# Altium project BEAGLEBONEBLACK_REV A5B.PrjPcb (part 5 of 6)

## Sheet P09_Ethernet.SchDoc
size A
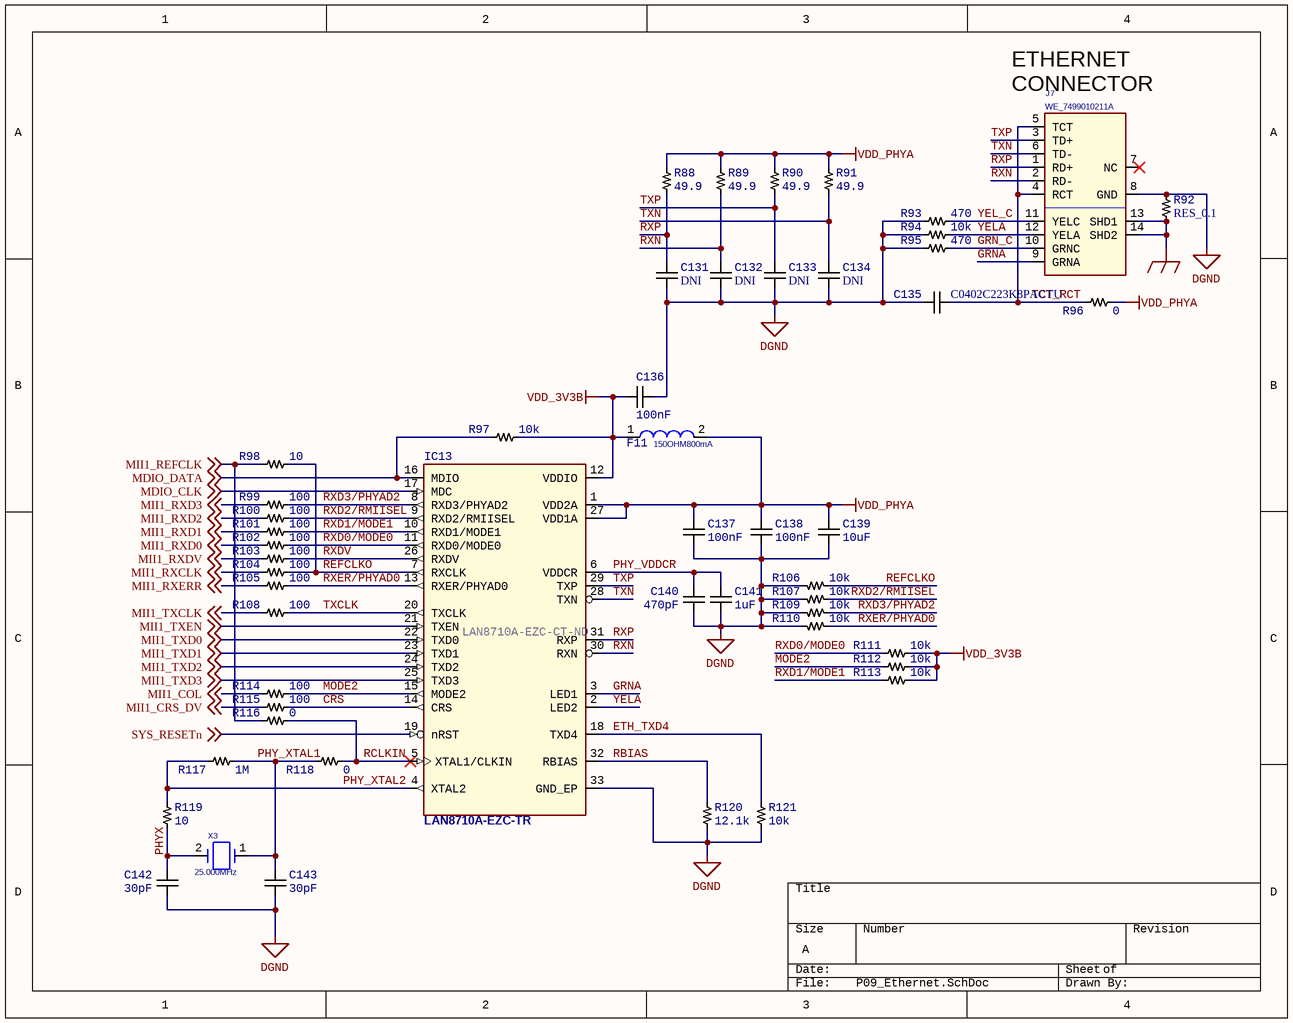
[diagram p7: P09_Ethernet.SchDoc]

### Parts
(Parts that share a designator on the sheet are numbered #1, #2 ... from top to bottom, then left to right.)
C131  DNI  [CAP0402_DNI]
C132  DNI  [CAP0402_DNI]
C133  DNI  [CAP0402_DNI]
C134  DNI  [CAP0402_DNI]
C135  C0402C223K8PACTU  [CAP0402]
C136  Capacitance: 100nF  [CAP0402]  (hidden comment: C0402C104K4RACTU)
C137  Capacitance: 100nF  [CAP0402]  (hidden comment: C0402C104K4RACTU)
C138  Capacitance: 100nF  [CAP0402]  (hidden comment: C0402C104K4RACTU)
C139  10uF  [CAP0805]
C140  470pF  [CAP0402]
C141  1uF  [CAP0402]
C142  Capacitance: 30pF  [CAP0402]  (hidden comment: CC0402JRNPO9BN300)
C143  Capacitance: 30pF  [CAP0402]  (hidden comment: CC0402JRNPO9BN300)
F11  150OHM800mA  [FB0805]
IC13  LAN8710A-EZC-TR  Supplier Part Number 2: LAN8710A-EZC-CT-ND  [QFN-32]
J7  WE_7499010211A  [RJ45-7499010211A]
R88#2  Resistance: 49.9  [RES0402]  (hidden comment: RC0402FR-0749R9)
R89#2  Resistance: 49.9  [RES0402]  (hidden comment: RC0402FR-0749R9)
R90#2  Resistance: 49.9  [RES0402]  (hidden comment: RC0402FR-0749R9)
R91#2  Resistance: 49.9  [RES0402]  (hidden comment: RC0402FR-0749R9)
R92#2  RES_0.1
R93#2  Resistance: 470  [RES0402]  (hidden comment: RC0402FR-07470RL)
R94#2  Resistance: 10k  [RES0402]  (hidden comment: RC0402FR-0710KL)
R95#2  Resistance: 470  [RES0402]  (hidden comment: RC0402FR-07470RL)
R96#2  Resistance: 0  [RES0402]  (hidden comment: RC0402JR-070RL)
R97#2  Resistance: 10k  [RES0402]  (hidden comment: RC0402FR-0710KL)
R98#2  Resistance: 10  [RES0402]  (hidden comment: RC0402FR-0710RL)
R99#2  Resistance: 100  [RES0402]  (hidden comment: RC0402FR-07100RL)
R100#2  Resistance: 100  [RES0402]  (hidden comment: RC0402FR-07100RL)
R101  Resistance: 100  [RES0402]  (hidden comment: RC0402FR-07100RL)
R102  Resistance: 100  [RES0402]  (hidden comment: RC0402FR-07100RL)
R103  Resistance: 100  [RES0402]  (hidden comment: RC0402FR-07100RL)
R104  Resistance: 100  [RES0402]  (hidden comment: RC0402FR-07100RL)
R105  Resistance: 100  [RES0402]  (hidden comment: RC0402FR-07100RL)
R106  Resistance: 10k  [RES0402]  (hidden comment: RC0402FR-0710KL)
R107  Resistance: 10k  [RES0402]  (hidden comment: RC0402FR-0710KL)
R108  Resistance: 100  [RES0402]  (hidden comment: RC0402FR-07100RL)
R109  Resistance: 10k  [RES0402]  (hidden comment: RC0402FR-0710KL)
R110  Resistance: 10k  [RES0402]  (hidden comment: RC0402FR-0710KL)
R111  Resistance: 10k  [RES0402]  (hidden comment: RC0402FR-0710KL)
R112  Resistance: 10k  [RES0402]  (hidden comment: RC0402FR-0710KL)
R113  Resistance: 10k  [RES0402]  (hidden comment: RC0402FR-0710KL)
R114  Resistance: 100  [RES0402]  (hidden comment: RC0402FR-07100RL)
R115  Resistance: 100  [RES0402]  (hidden comment: RC0402FR-07100RL)
R116  Resistance: 0  [RES0402]  (hidden comment: RC0402JR-070RL)
R117  Resistance: 1M  [RES0402]  (hidden comment: RC0402FR-071ML)
R118  Resistance: 0  [RES0402]  (hidden comment: RC0402JR-070RL)
R119  Resistance: 10  [RES0402]  (hidden comment: RC0402FR-0710RL)
R120  Resistance: 12.1k  [RES0402]  (hidden comment: RC0402FR-0712K1L)
R121  Resistance: 10k  [RES0402]  (hidden comment: RC0402FR-0710KL)
X3  25.000MHz  [XTAL150SMD_125X196]

### Nets
DGND: C131.2 C132.2 C133.2 C134.2 C135.1 C136.2 C137.2 C138.2 C139.1 C140.2 C141.2 C142.2 C143.2 IC13.33(GND_EP) J7.8(GND) R92#2.2 R93#2.2 R94#2.2 R95#2.2 R106.2 R107.2 R109.2 R110.2 R120.1 R121.1
GND_EARTH: J7.13(SHD1) J7.14(SHD2) R92#2.1
VDD_3V3B: C136.1 F11.1 IC13.12(VDDIO) R97#2.1 R111.2 R112.2 R113.2
VDD_PHYA: C137.1 C138.1 C139.2 F11.2 IC13.1(VDD2A) IC13.27(VDD1A) R88#2.1 R89#2.1 R90#2.1 R91#2.1 R96#2.1
CRS: IC13.14(CRS) R115.1
ETH_TXD4: IC13.18(TXD4) R121.2
GRN_C: J7.10(GRNC) R95#2.1
GRNA: IC13.3(LED1) J7.9(GRNA)
MDIO_CLK: IC13.17(MDC) ; off-sheet MDIO_CLK
MDIO_DATA: IC13.16(MDIO) R97#2.2 ; off-sheet MDIO_DATA
MII1_COL: R114.2 ; off-sheet MII1_COL
MII1_CRS_DV: R115.2 ; off-sheet MII1_CRS_DV
MII1_REFCLK: R98#2.2 R116.2 ; off-sheet MII1_REFCLK
MII1_RXCLK: R104.2 ; off-sheet MII1_RXCLK
MII1_RXD0: R102.2 ; off-sheet MII1_RXD0
MII1_RXD1: R101.2 ; off-sheet MII1_RXD1
MII1_RXD2: R100#2.2 ; off-sheet MII1_RXD2
MII1_RXD3: R99#2.2 ; off-sheet MII1_RXD3
MII1_RXDV: R103.2 ; off-sheet MII1_RXDV
MII1_RXERR: R105.2 ; off-sheet MII1_RXERR
MII1_TXCLK: R108.2 ; off-sheet MII1_TXCLK
MII1_TXD0: IC13.22(TXD0) ; off-sheet MII1_TXD0
MII1_TXD1: IC13.23(TXD1) ; off-sheet MII1_TXD1
MII1_TXD2: IC13.24(TXD2) ; off-sheet MII1_TXD2
MII1_TXD3: IC13.25(TXD3) ; off-sheet MII1_TXD3
MII1_TXEN: IC13.21(TXEN) ; off-sheet MII1_TXEN
MODE2: IC13.15(MODE2) R112.1 R114.1
PHY_VDDCR: C140.1 C141.1 IC13.6(VDDCR)
PHY_XTAL1: C143.1 R117.1 R118.2 X3.1
PHY_XTAL2: IC13.4(XTAL2) R117.2 R119.2
PHYX: C142.1 R119.1 X3.2
RBIAS: IC13.32(RBIAS) R120.2
RCLKIN: IC13.5(XTAL1/CLKIN) R116.1 R118.1
REFCLKO: IC13.7(RXCLK) R98#2.1 R104.1 R106.1
RXD0/MODE0: IC13.11(RXD0/MODE0) R102.1 R111.1
RXD1/MODE1: IC13.10(RXD1/MODE1) R101.1 R113.1
RXD2/RMIISEL: IC13.9(RXD2/RMIISEL) R100#2.1 R107.1
RXD3/PHYAD2: IC13.8(RXD3/PHYAD2) R99#2.1 R109.1
RXDV: IC13.26(RXDV) R103.1
RXER/PHYAD0: IC13.13(RXER/PHYAD0) R105.1 R110.1
RXN: C132.1 IC13.30(RXN) J7.2(RD-) R89#2.2
RXP: C131.1 IC13.31(RXP) J7.1(RD+) R88#2.2
SYS_RESETn: IC13.19(nRST) ; off-sheet SYS_RESETn
TCT_RCT: C135.2 J7.4(RCT) J7.5(TCT) R96#2.2
TXCLK: IC13.20(TXCLK) R108.1
TXN: C134.1 IC13.28(TXN) J7.6(TD-) R91#2.2
TXP: C133.1 IC13.29(TXP) J7.3(TD+) R90#2.2
YEL_C: J7.11(YELC) R93#2.1
YELA: IC13.2(LED2) J7.12(YELA) R94#2.1

Not connected (* = marked no-connect by the designer): J7 7(NC)*

### Notes on the sheet
- (near J7) ETHERNET
  CONNECTOR
- Title
- Size:
- Date:
- A4
- Number:
- Time:
- Revision:
- Sheet
- of
- File:

### Library data of the parts
C131-C134 = CAP_15pF_DNI: No insert capacitor
C135 = CAP_22nF: MLCC 22nF 0402 SMD; Manufacturer: KEMET; Tolerance: 10%; Dielectric Material: Ceramic; Voltage Rating: 10V; Dielectric: X5R; Dissipation Factor: 5%; Supplier 1: Digi-Key; Manufacturer Part Number: C0402C223K8PACTU; RoHS: Yes; Stock 1: 94645; Pricing 1: 1=0.30000, 10=0.20900, 100=0.11830, 500=0.08350, 1000=0.07307, 2500=0.06959, 5000=0.06437 (USD); Capacitance: 22nF; Packaging: Tape and Reel; ComponentLink1URL: https://datasheet.ciiva.com/146/docfinderpartnumber-c0402c223k8pactu-146023.pdf?src-supplier=Digi-Key; ComponentLink1Description: https://datasheet.ciiva.com/146/docfinderpartnumber-c0402c223k8pactu-146023.pdf?src-supplier=Digi-Key; Mount: Surface Mount,PCB; Case/Package: 0402; Case Code (Metric): 1005; Case Code (Imperial): 0402; Min Operating Temperature: -55°C; Max Operating Temperature: 85°C; Package Quantity: 1; Voltage Rating (DC): 10V; Termination: SMD/SMT; Voltage: 10V; Length: 1mm; Height: 0.5mm; Width: 0.02inch; Thickness: 0.022inch; Lead Pitch: 0.3mm; Depth: 0.5mm; Radiation Hardening: No; REACH SVHC: No SVHC; Lead Free: Lead Free
C136-C138 = CAP_100nF: as C107-C117 on sheet P07_DDR3 Memory; Supplier 1: Digi-Key; Supplier Part Number 1: 399-3521-1-ND; Manufacturer Part Number: C0402C104K4RACTU; RoHS: Yes; Stock 1: 6512243; Pricing 1: 1=0.10000, 10=0.04200, 100=0.01860, 500=0.01328, 1000=0.01044, 2500=0.00949, 5000=0.00873 (USD); Packaging: Tape and Reel; Mount: Surface Mount; Case/Package: 0402; Case Code (Imperial): 0402; Case Code (Metric): 1005; Contact Plating: Tin,Matte; Min Operating Temperature: -55°C; Max Operating Temperature: 125°C; Package Quantity: 10000; Voltage Rating: 16V; Termination: SMD/SMT; Length: 1mm; Height: 0.5mm; Width: 0.5mm; Depth: 0.5mm; Radiation Hardening: No; ComponentLink2URL: https://datasheet.ciiva.com/18192/getdatasheetpartid-385384-18192412.pdf?src-supplier=Verical; ComponentLink2Description: Datasheet
C139 = CAP_10uF: MLCC 10uF 0805 SMD; Manufacturer: TDK; Manufacturer Part Number: C2012X6S1A106K085AC; Tolerance: 10%; Dielectric Material: Ceramic; Voltage Rating: 10V; Dielectric: X6S; Supplier 1: Digi-Key; Supplier Part Number 1: 445-7613-1-ND; RoHS: Yes; Stock 1: 46852; Pricing 1: 1=0.30000, 10=0.20500, 100=0.11610, 500=0.08198, 1000=0.07173 (USD); Capacitance: 10uF; Packaging: Tape and Reel; Mount: Surface Mount; Case/Package: 0805; Weight: 0.000194oz; Case Code (Metric): 2012; Case Code (Imperial): 0805; Min Operating Temperature: -55°C; Max Operating Temperature: 105°C; Termination: SMD/SMT; Package Quantity: 4000; Voltage Rating (DC): 10V; Composition: Ceramic; Length: 2mm; Height: 1.25mm; Depth: 1.25mm; Width: 0.049inch; Thickness: 0.037inch; REACH SVHC: No SVHC; Lead Free: Lead Free; ComponentLink3URL: https://datasheet.ciiva.com/6290/tdkmlcccaprange-6290501.pdf?src-supplier=Digi-Key; ComponentLink3Description: Datasheet
C140 = CAP_470pF: MLCC 470pF 0402 SMD; Manufacturer: Murata; Manufacturer Part Number: GRM155R71H471KA01D; Tolerance: 10%; Material: Ceramic; Dielectric: X7R; Voltage Rating: 50V; Supplier 1: Digi-Key; Supplier Part Number 1: 490-1300-1-ND; RoHS: Yes; Stock 1: 1824670; Pricing 1: 1=0.10000, 10=0.04900, 100=0.02200, 500=0.01572, 1000=0.01235, 2500=0.01122, 5000=0.01033 (USD); Capacitance: 470pF; Packaging: Tape and Reel; ComponentLink1URL: https://datasheet.ciiva.com/11786/0900766b80ef921d-11786912.pdf?src-supplier=RSComponents; ComponentLink1Description: https://datasheet.ciiva.com/11786/0900766b80ef921d-11786912.pdf?src-supplier=RSComponents; Mount: Surface Mount; Case/Package: 0402; Number of Pins: 2; Case Code (Metric): 1005; Case Code (Imperial): 0402; Min Operating Temperature: -55°C; Max Operating Temperature: 125°C; Package Quantity: 1; Voltage Rating (DC): 50V; Termination: SMD/SMT; Voltage: 50V; Length: 1mm; Height: 0.5mm; Width: 0.02inch; Thickness: 0.022inch; Depth: 0.5mm; Radiation Hardening: No; REACH SVHC: No SVHC; Lead Free: Lead Free; ComponentLink2URL: https://datasheet.ciiva.com/18101/getdatasheetpartid-37722-18101030.pdf?src-supplier=Verical; ComponentLink2Description: https://datasheet.ciiva.com/18101/getdatasheetpartid-37722-18101030.pdf?src-supplier=Verical; ComponentLink3URL: https://datasheet.ciiva.com/19476/1856505-19476137.pdf?src-supplier=Jameco; ComponentLink3Description: https://datasheet.ciiva.com/19476/1856505-19476137.pdf?src-supplier=Jameco; ComponentLink4URL: https://datasheet.ciiva.com/29199/454340-da-01-en-vs-kondensator-0402-29199656.pdf?src-supplier=Conrad; ComponentLink4Description: https://datasheet.ciiva.com/29199/454340-da-01-en-vs-kondensator-0402-29199656.pdf?src-supplier=Conrad; ComponentLink5URL: https://datasheet.ciiva.com/129/partnumbering-e-01-129843.pdf?src-supplier=Digi-Key; ComponentLink5Description: https://datasheet.ciiva.com/129/partnumbering-e-01-129843.pdf?src-supplier=Digi-Key; ComponentLink6URL: https://datasheet.ciiva.com/129/partnumbering-e-01-129844.pdf?src-supplier=Digi-Key; ComponentLink6Description: https://datasheet.ciiva.com/129/partnumbering-e-01-129844.pdf?src-supplier=Digi-Key; ComponentLink7URL: https://datasheet.ciiva.com/129/partnumbering-e-01-129845.pdf?src-supplier=Digi-Key; ComponentLink7Description: https://datasheet.ciiva.com/129/partnumbering-e-01-129845.pdf?src-supplier=Digi-Key; ComponentLink8URL: https://datasheet.ciiva.com/14116/grmseries-highdielectrictype-eng-14116837.pdf?src-supplier=Distrelec; ComponentLink8Description: https://datasheet.ciiva.com/14116/grmseries-highdielectrictype-eng-14116837.pdf?src-supplier=Distrelec; ComponentLink9URL: https://datasheet.ciiva.com/22698/608985-22698425.pdf?src-supplier=Element14; ComponentLink9Description: https://datasheet.ciiva.com/22698/608985-22698425.pdf?src-supplier=Element14; ComponentLink10URL: https://datasheet.ciiva.com/16199/product-16199180.pdf?src-supplier=Future+Electronics; ComponentLink10Description: https://datasheet.ciiva.com/16199/product-16199180.pdf?src-supplier=Future+Electronics; ComponentLink11URL: https://datasheet.ciiva.com/7937/608985-7937630.pdf?src-supplier=Element14; ComponentLink11Description: https://datasheet.ciiva.com/7937/608985-7937630.pdf?src-supplier=Element14
C141 = CAP_1uF: MLCC 1uF 0402 SMD; Manufacturer: Yageo; Manufacturer Part Number: CC0402KRX5R6BB105; Tolerance: 10%; Dielectric: X5R; Voltage Rating: 10V; Dissipation Factor: 15%; Capacitance: 1uF; ComponentLink1Description: https://datasheet.ciiva.com/176/upy-gphc-x5r-4v-to-50v-12-176704.pdf?src-supplier=Digi-Key; ComponentLink1URL: https://datasheet.ciiva.com/176/upy-gphc-x5r-4v-to-50v-12-176704.pdf?src-supplier=Digi-Key; Packaging: Tape and Reel; Pricing 1: 1=0.10000, 10=0.06300, 100=0.02790, 500=0.01996, 1000=0.01568, 2500=0.01425, 5000=0.01311 (USD); RoHS: Yes; Stock 1: 6411796; Supplier 1: Digi-Key; Mount: Surface Mount; Case/Package: 0402; Number of Pins: 2; Case Code (Metric): 1005; Case Code (Imperial): 0402; Min Operating Temperature: -55°C; Max Operating Temperature: 85°C; Package Quantity: 1; Voltage Rating (DC): 10V; Termination: SMD/SMT; Composition: Ceramic; Length: 1mm; Height: 0.5mm; Width: 0.02inch; Thickness: 0.022inch; Depth: 0.5mm; Radiation Hardening: No; REACH SVHC: No SVHC; Lead Free: Lead Free; Halogen Free: Halogen Free; ComponentLink2URL: https://datasheet.ciiva.com/176/mlccorderingcode-176706.pdf?src-supplier=Digi-Key; ComponentLink2Description: https://datasheet.ciiva.com/176/mlccorderingcode-176706.pdf?src-supplier=Digi-Key; ComponentLink3URL: https://datasheet.ciiva.com/176/mlccorderingcode-176705.pdf?src-supplier=Digi-Key; ComponentLink3Description: https://datasheet.ciiva.com/176/mlccorderingcode-176705.pdf?src-supplier=Digi-Key
C142 C143 = CAP_30pF: MLCC 30pF 0402 SMD; Manufacturer: Yageo; Tolerance: 5%; Voltage Rating: 50V; Dielectric: C0G; Supplier 1: Digi-Key; Manufacturer Part Number: CC0402JRNPO9BN300; Stock 1: 51709; Pricing 1: 1=0.10000, 10=0.04200, 100=0.01890, 500=0.01348, 1000=0.01059, 2500=0.00962, 5000=0.00886 (USD); RoHS: Yes; Mount: Surface Mount; Case/Package: 0402; Number of Pins: 2; Weight: 2.3E-05oz; Case Code (Imperial): 0402; Case Code (Metric): 1005; Min Operating Temperature: -55°C; Max Operating Temperature: 125°C; Voltage Rating (DC): 50V; Packaging: Tape and Reel; Termination: SMD/SMT; Composition: Ceramic; Length: 1mm; Width: 0.02inch; Thickness: 0.022inch; Depth: 0.5mm; Lead Free: Lead Free; ComponentLink1URL: https://datasheet.ciiva.com/13263/upy-gp-np0-16v-to-50v-8-3714-13263961.pdf?src-supplier=Mouser; ComponentLink1Description: https://datasheet.ciiva.com/13263/upy-gp-np0-16v-to-50v-8-3714-13263961.pdf?src-supplier=Mouser; Supplier Part Number 1: 311-1666-1-ND
F11 = FERR: FERRITE 800MA 150 OHM 0805 SMD; PartName: FerriteBead150ohm800mA; Mfr: Steward; MfrNum: LI0805H151R-10; TIIntPartnumber: 1L0010; Manufacturer: Laird-Signal Integrity Products; Vendor: Digikey; DC Resistance (DCR): 150 mOhm Max; Filter Type: Differential Mode - Single; Impedance @ Frequency: 150 Ohm @ 100MHz; Category: Filters; ComponentLink1Description: http://www.lairdtech.com/WorkArea/linkit.aspx?LinkIdentifier=id&ItemID=4912; ComponentLink1URL: http://www.lairdtech.com/WorkArea/linkit.aspx?LinkIdentifier=id&ItemID=4912; Current Rating: 800mA; Height (Max): 0.043" (1.10mm); Manufacturer Part Number: LI0805H151R-10; Mounting Type: Surface Mount; Package / Case: 0805 (2012 Metric); Packaging: Digi-Reel®; Pricing 1: 1=0.1, 10=0.07, 25=0.064, 50=0.0574, 100=0.0421, 250=0.03064, 500=0.02808, 1000=0.02424 (USD); RoHS: RoHS Compliant; Size / Dimension: 0.079" L x 0.049" W (2.00mm x 1.25mm); Stock 1: 3694; Supplier 1: Digi-Key; Supplier Part Number 1: 240-2384-6-ND
IC13 = IC_Ethernet_XCVR: Ethernet ICs 10/100 Ethernet XCVR w/HPAutoMDIX FlexPwr; PART#: SMSC LAN8710A-EZK; Manufacturer: Microchip Technology; Manufacturer Part Number: LAN8710A-EZK-TR; Data Rate: 125 Mb/s; Number of Transceivers: 1; Standard Supported: 802.3, 802.3u; Supply Voltage - Max: 3.6 V; Supply Voltage - Min: 1.6 V, 3 V; Max Supply Voltage: 3.6V; Min Supply Voltage: 1.62V; Max Supply Current: 24.1mA; Number of LEDs: 4; Max Power Dissipation: 176mW; Simplex/Duplex: Full Duplex; Supplier 1: Mouser; Supplier Part Number 1: 886-LAN8710A-EZK-TR; RoHS: RoHS Compliant; Category: Ethernet ICs; Stock 1: 12109; Pricing 1: 1=1.70, 10=1.47, 25=1.23, 100=1.11, 4000=1.11 (AUD); Package / Case: QFN-32; Packaging: Reel; Product: Ethernet Transceivers; Type: Single Chip; Mounting Style: SMD/SMT; Maximum Operating Temperature: + 85 C; Minimum Operating Temperature: 0 C; Product Category: Ethernet Controllers; RoHS - Mouser: Y; Minimum Order Quantity: 1; Reeling: True; ComponentLink1URL: http://www.smsc.com/media/Downloads_Public/Data_Sheets/8710a.pdf; ComponentLink1Description: http://www.smsc.com/media/Downloads_Public/Data_Sheets/8710a.pdf; Supplier 2: Digi-Key; Stock 2: 14307; Pricing 2: 1=1.25000, 25=1.04280 (USD); Case/Package: QFN; Number of Pins: 32; Min Operating Temperature: 0°C; Max Operating Temperature: 85°C; Package Quantity: 4000; Number of Channels: 1; Length: 5.1mm; Height: 0.95mm; Width: 5.1mm; Lead Free: Lead Free; ComponentLink2URL: https://datasheet.ciiva.com/26913/getdatasheetpartid-766967-26913043.pdf?src-supplier=Verical; ComponentLink2Description: https://datasheet.ciiva.com/26913/getdatasheetpartid-766967-26913043.pdf?src-supplier=Verical; ComponentLink3URL: https://datasheet.ciiva.com/29718/8710adb-29718636.pdf?src-supplier=Digi-Key; ComponentLink3Description: https://datasheet.ciiva.com/29718/8710adb-29718636.pdf?src-supplier=Digi-Key; ComponentLink4URL: https://datasheet.ciiva.com/29718/8710adb-29718637.pdf?src-supplier=Digi-Key; ComponentLink4Description: https://datasheet.ciiva.com/29718/8710adb-29718637.pdf?src-supplier=Digi-Key
J7 = CONN_RJ45_MAG_WE_0: WE-RJ45 LAN Transformer
R88#2 R89#2 R90#2 R91#2 = RES_49.9: Resistor 49.9Ohm 0402 SMD; Manufacturer: Yageo; Manufacturer Part Number: RC0402FR-0749R9L; Temperature Coefficient: 100ppm/°C; Tolerance: 1%; Max Power Dissipation: 63mW; Power Rating: 62.5mW; Voltage Rating: 50V; ComponentLink1Description: https://datasheet.ciiva.com/11819/0900766b80c66297-11819508.pdf?src-supplier=RSComponents; ComponentLink1URL: https://datasheet.ciiva.com/11819/0900766b80c66297-11819508.pdf?src-supplier=RSComponents; Composition: Thick Film; Features: Moisture Resistant; Height: 0.016inch; Number of Terminations: 2; Packaging: Tape and Reel; Pricing 1: 1=0.10000, 10=0.01600, 100=0.00640, 1000=0.00289, 2500=0.00251, 5000=0.00207 (USD); RoHS: Yes; Stock 1: 17398038; Supplier 1: Digi-Key; Case/Package: 0402; Number of Pins: 2; Case Code (Imperial): 0402; Case Code (Metric): 1005; Min Operating Temperature: -55°C; Max Operating Temperature: 155°C; Package Quantity: 1; Termination: SMD/SMT; Military Standard: Not; Voltage Rating (DC): 50V; Working Voltage: 50V; Length: 1mm; Width: 0.5mm; Depth: 0.5mm; REACH SVHC: No SVHC; Lead Free: Lead Free; ComponentLink2URL: https://datasheet.ciiva.com/7983/1018594-7983542.pdf?src-supplier=Element14; ComponentLink2Description: https://datasheet.ciiva.com/7983/1018594-7983542.pdf?src-supplier=Element14; ComponentLink3URL: https://datasheet.ciiva.com/16743/pyu-rc0402-51-rohs-l-6-r-16743942.pdf?src-supplier=Future+Electronics; ComponentLink3Description: https://datasheet.ciiva.com/16743/pyu-rc0402-51-rohs-l-6-r-16743942.pdf?src-supplier=Future+Electronics; ComponentLink4URL: https://datasheet.ciiva.com/22747/1018594-22747514.pdf?src-supplier=Element14; ComponentLink4Description: https://datasheet.ciiva.com/22747/1018594-22747514.pdf?src-supplier=Element14; ComponentLink5URL: https://datasheet.ciiva.com/2453/pyu-r-int-thick-7-2453355.pdf?src-supplier=Digi-Key; ComponentLink5Description: https://datasheet.ciiva.com/2453/pyu-r-int-thick-7-2453355.pdf?src-supplier=Digi-Key; ComponentLink6URL: https://datasheet.ciiva.com/2453/pyu-r-int-thick-7-2453356.pdf?src-supplier=Digi-Key; ComponentLink6Description: https://datasheet.ciiva.com/2453/pyu-r-int-thick-7-2453356.pdf?src-supplier=Digi-Key; ComponentLink7URL: https://datasheet.ciiva.com/2453/pyu-r-int-thick-7-2453357.pdf?src-supplier=Digi-Key; ComponentLink7Description: https://datasheet.ciiva.com/2453/pyu-r-int-thick-7-2453357.pdf?src-supplier=Digi-Key
R92#2 = RES_0.1: Resistor 0.1Ohm 0805 SMD
R93#2 R95#2 = RES_470: Resistor 470Ohm 0402 SMD; Manufacturer: Yageo Phycomp; Temperature Coefficient: 100ppm/°C; Tolerance: 1%; Power Rating: 63mW; Voltage Rating (DC): 50V; Supplier 1: Digi-Key; Manufacturer Part Number: RC0402FR-07470RL; RoHS: Yes; Stock 1: 4454412; Pricing 1: 1=0.10000, 10=0.01600, 100=0.00640, 1000=0.00289, 2500=0.00251, 5000=0.00207 (USD); Height: 0.32mm; Number of Terminations: 2; Packaging: Cut Tape; ComponentLink1URL: http://www.farnell.com/datasheets/2167052.pdf?src-supplier=Farnell; ComponentLink1Description: http://www.farnell.com/datasheets/2167052.pdf?src-supplier=Farnell; Mount: Surface Mount; Case/Package: 0402; Number of Pins: 2; Min Operating Temperature: -55°C; Max Operating Temperature: 155°C; Working Voltage: 50V; Length: 1mm; Depth: 0.5mm; Width: 500um; REACH SVHC: No SVHC; Lead Free: Lead Free; ComponentLink2URL: http://www.yageo.com/documents/recent/PYu-RC_Group_51_RoHS_L_10.pdf?src-supplier=Digi-Key; ComponentLink2Description: http://www.yageo.com/documents/recent/PYu-RC_Group_51_RoHS_L_10.pdf?src-supplier=Digi-Key; ComponentLink3URL: http://www.farnell.com/datasheets/2167052.pdf?src-supplier=Newark; ComponentLink3Description: http://www.farnell.com/datasheets/2167052.pdf?src-supplier=Newark
R94#2 R97#2 R106 R107 R109-R113 R121 = RES_10k: Resistor 10kOhm 0402 SMD; Manufacturer: Yageo; Temperature Coefficient: 100ppm/°C; Tolerance: 1%; Voltage Rating (DC): 50V; Power Rating: 62.5mW; ComponentLink1Description: https://datasheet.ciiva.com/7660/38568-7660787.pdf?src-supplier=Element14; ComponentLink1URL: https://datasheet.ciiva.com/7660/38568-7660787.pdf?src-supplier=Element14; Composition: Thick Film; Height: 0.32mm; Manufacturer Part Number: RC0402FR-0710KL; Number of Terminations: 2; Packaging: Tape and Reel; Pricing 1: 1=0.10000, 10=0.01500, 100=0.00600, 1000=0.00270, 2500=0.00235, 5000=0.00194 (USD); RoHS: Yes; Stock 1: 72891652; Supplier 1: Digi-Key; Case/Package: 0402; Number of Pins: 2; Case Code (Imperial): 0402; Case Code (Metric): 1005; Min Operating Temperature: -55°C; Max Operating Temperature: 155°C; Voltage Rating: 50V; Termination: SMD/SMT; Military Standard: Not; Working Voltage: 50V; Length: 1mm; Width: 0.5mm; Depth: 0.5mm; Lead Pitch: 0.2mm; REACH SVHC: No SVHC; Lead Free: Lead Free; ComponentLink2URL: https://datasheet.ciiva.com/7983/1018594-7983486.pdf?src-supplier=Element14; ComponentLink2Description: https://datasheet.ciiva.com/7983/1018594-7983486.pdf?src-supplier=Element14; ComponentLink3URL: https://datasheet.ciiva.com/7849/1784430-7849813.pdf?src-supplier=Element14; ComponentLink3Description: https://datasheet.ciiva.com/7849/1784430-7849813.pdf?src-supplier=Element14; ComponentLink4URL: https://datasheet.ciiva.com/7849/1686128-7849814.pdf?src-supplier=Element14; ComponentLink4Description: https://datasheet.ciiva.com/7849/1686128-7849814.pdf?src-supplier=Element14; ComponentLink5URL: https://datasheet.ciiva.com/7849/1784430-7849815.pdf?src-supplier=Element14; ComponentLink5Description: https://datasheet.ciiva.com/7849/1784430-7849815.pdf?src-supplier=Element14; ComponentLink6URL: https://datasheet.ciiva.com/22747/1018594-22747512.pdf?src-supplier=Element14; ComponentLink6Description: https://datasheet.ciiva.com/22747/1018594-22747512.pdf?src-supplier=Element14; ComponentLink7URL: https://datasheet.ciiva.com/12667/pyu-rc0402-51-rohs-l-6-r-12667067.pdf?src-supplier=Mouser; ComponentLink7Description: https://datasheet.ciiva.com/12667/pyu-rc0402-51-rohs-l-6-r-12667067.pdf?src-supplier=Mouser
R96#2 R116 R118 = RES_0: Resistor 0Ohm 0402 SMD; Manufacturer: Yageo; Temperature Coefficient: 200ppm/°C; Tolerance: 5%; Power Rating: 62.5mW; Voltage Rating: 50V; Max Power Dissipation: 63mW; ComponentLink1Description: Digikey; ComponentLink1URL: https://www.digikey.com/product-detail/en/yageo/RC0402JR-070RL/311-0.0JRCT-ND/729353; Composition: Thick Film; Features: Moisture Resistant; Height: 0.016inch; Manufacturer Part Number: RC0402JR-070RL; Number of Terminations: 2; Packaging: Tape and Reel; Pricing 1: 1=0.10000, 10=0.01300, 25=0.00920, 50=0.00700, 100=0.00510, 250=0.00392, 500=0.00312, 1000=0.00230, 5000=0.00165 (USD); RoHS: Yes; Stock 1: 68160806; Supplier 1: Digi-Key; Supplier Part Number 1: 311-0.0JRCT-ND; Case/Package: 0402; Contact Plating: Tin,Matte; Case Code (Metric): 1005; Case Code (Imperial): 0402; Min Operating Temperature: -55°C; Max Operating Temperature: 155°C; Termination: SMD/SMT; Package Quantity: 1; Military Standard: Not; Length: 1mm; Width: 0.02inch; Depth: 0.5mm; Radiation Hardening: No; Lead Free: Lead Free; REACH SVHC: Unknown; ComponentLink2Description: Datasheet; ComponentLink2URL: https://www.yageo.com/upload/media/product/productsearch/datasheet/rchip/PYu-RC_Group_51_RoHS_L_10.pdf
R98#2 R119 = RES_10: Resistor 10Ohm 0402 SMD; Manufacturer: Yageo; Temperature Coefficient: 100ppm/°C; Tolerance: 1%; Power Rating: 63mW; Voltage Rating: 50V; ComponentLink1Description: https://datasheet.ciiva.com/11808/0900766b80c66297-11808764.pdf?src-supplier=RSComponents; ComponentLink1URL: https://datasheet.ciiva.com/11808/0900766b80c66297-11808764.pdf?src-supplier=RSComponents; Composition: Thick Film; Height: 0.32mm; Manufacturer Part Number: RC0402FR-0710RL; Number of Terminations: 2; Packaging: Tape and Reel; Pricing 1: 1=0.10000, 10=0.02400, 100=0.00970, 1000=0.00435, 2500=0.00377, 5000=0.00312 (USD); RoHS: Yes; Stock 1: 10105841; Supplier 1: Digi-Key; Case/Package: 0402; Case Code (Imperial): 0402; Case Code (Metric): 1005; Min Operating Temperature: -55°C; Max Operating Temperature: 155°C; Termination: SMD/SMT; Military Standard: Not; Working Voltage: 50V; Length: 1mm; Depth: 0.5mm; REACH SVHC: Unknown; Lead Free: Lead Free; ComponentLink2URL: https://datasheet.ciiva.com/7849/1018594-7849818.pdf?src-supplier=Element14; ComponentLink2Description: https://datasheet.ciiva.com/7849/1018594-7849818.pdf?src-supplier=Element14; ComponentLink3URL: https://datasheet.ciiva.com/46394/1018594-46394954.pdf?src-supplier=Element14; ComponentLink3Description: https://datasheet.ciiva.com/46394/1018594-46394954.pdf?src-supplier=Element14; ComponentLink4URL: https://datasheet.ciiva.com/7849/1018594-7849819.pdf?src-supplier=Element14; ComponentLink4Description: https://datasheet.ciiva.com/7849/1018594-7849819.pdf?src-supplier=Element14; ComponentLink5URL: https://datasheet.ciiva.com/15189/getdatasheetpartid-323697-15189339.pdf?src-supplier=Verical; ComponentLink5Description: https://datasheet.ciiva.com/15189/getdatasheetpartid-323697-15189339.pdf?src-supplier=Verical
R99#2 R100#2 R101-R105 R115 = RES_100: Resistor 100Ohm 0402 SMD; Manufacturer: Yageo; Temperature Coefficient: 100ppm/°C; Tolerance: 1%; Power Rating: 62.5mW; Voltage Rating: 50V; RoHS: Yes; Supplier 1: Digi-Key; Manufacturer Part Number: RC0402FR-07100RL; Stock 1: 45000776; Pricing 1: 1=0.10000, 10=0.01600, 100=0.00640, 1000=0.00289, 2500=0.00251, 5000=0.00207 (USD); Composition: Thick Film; Height: 0.32mm; Packaging: Tape and Reel; ComponentLink1URL: https://datasheet.ciiva.com/7849/1784430-7849810.pdf?src-supplier=Element14; ComponentLink1Description: https://datasheet.ciiva.com/7849/1784430-7849810.pdf?src-supplier=Element14; Case/Package: 0402; Number of Pins: 2; Case Code (Imperial): 0402; Case Code (Metric): 1005; Min Operating Temperature: -55°C; Max Operating Temperature: 155°C; Military Standard: Not; Voltage Rating (DC): 50V; Termination: SMD/SMT; Length: 1mm; Width: 0.5mm; Depth: 0.5mm; REACH SVHC: No SVHC; Lead Free: Lead Free; ComponentLink2URL: https://datasheet.ciiva.com/11808/0900766b80c66297-11808765.pdf?src-supplier=RSComponents; ComponentLink2Description: https://datasheet.ciiva.com/11808/0900766b80c66297-11808765.pdf?src-supplier=RSComponents; ComponentLink3URL: https://datasheet.ciiva.com/12667/pyu-rc0402-51-rohs-l-6-r-12667957.pdf?src-supplier=Mouser; ComponentLink3Description: https://datasheet.ciiva.com/12667/pyu-rc0402-51-rohs-l-6-r-12667957.pdf?src-supplier=Mouser; ComponentLink4URL: https://datasheet.ciiva.com/22747/1018594-22747511.pdf?src-supplier=Element14; ComponentLink4Description: https://datasheet.ciiva.com/22747/1018594-22747511.pdf?src-supplier=Element14; ComponentLink5URL: https://datasheet.ciiva.com/28367/1018594-28367226.pdf?src-supplier=Element14; ComponentLink5Description: https://datasheet.ciiva.com/28367/1018594-28367226.pdf?src-supplier=Element14; ComponentLink6URL: https://datasheet.ciiva.com/16740/pyu-rc0402-51-rohs-l-6-r-16740566.pdf?src-supplier=Future+Electronics; ComponentLink6Description: https://datasheet.ciiva.com/16740/pyu-rc0402-51-rohs-l-6-r-16740566.pdf?src-supplier=Future+Electronics; ComponentLink7URL: https://datasheet.ciiva.com/15189/getdatasheetpartid-329466-15189335.pdf?src-supplier=Verical; ComponentLink7Description: https://datasheet.ciiva.com/15189/getdatasheetpartid-329466-15189335.pdf?src-supplier=Verical
R108 R114 = RES_100: Resistor 100Ohm 0402 SMD; Manufacturer: Yageo; Tolerance: 1%; Temperature Coefficient: 100ppm/°C; Power Rating: 62.5mW; Voltage Rating: 50V; RoHS: Yes; Supplier 1: Digi-Key; Manufacturer Part Number: RC0402FR-07100RL; Stock 1: 45000776; Pricing 1: 1=0.10000, 10=0.01600, 100=0.00640, 1000=0.00289, 2500=0.00251, 5000=0.00207 (USD); Composition: Thick Film; Height: 0.32mm; Packaging: Tape and Reel; ComponentLink1URL: https://datasheet.ciiva.com/7849/1784430-7849810.pdf?src-supplier=Element14; ComponentLink1Description: https://datasheet.ciiva.com/7849/1784430-7849810.pdf?src-supplier=Element14; Case/Package: 0402; Number of Pins: 2; Case Code (Imperial): 0402; Case Code (Metric): 1005; Min Operating Temperature: -55°C; Max Operating Temperature: 155°C; Military Standard: Not; Voltage Rating (DC): 50V; Termination: SMD/SMT; Length: 1mm; Width: 0.5mm; Depth: 0.5mm; REACH SVHC: No SVHC; Lead Free: Lead Free; ComponentLink2URL: https://datasheet.ciiva.com/11808/0900766b80c66297-11808765.pdf?src-supplier=RSComponents; ComponentLink2Description: https://datasheet.ciiva.com/11808/0900766b80c66297-11808765.pdf?src-supplier=RSComponents; ComponentLink3URL: https://datasheet.ciiva.com/12667/pyu-rc0402-51-rohs-l-6-r-12667957.pdf?src-supplier=Mouser; ComponentLink3Description: https://datasheet.ciiva.com/12667/pyu-rc0402-51-rohs-l-6-r-12667957.pdf?src-supplier=Mouser; ComponentLink4URL: https://datasheet.ciiva.com/22747/1018594-22747511.pdf?src-supplier=Element14; ComponentLink4Description: https://datasheet.ciiva.com/22747/1018594-22747511.pdf?src-supplier=Element14; ComponentLink5URL: https://datasheet.ciiva.com/28367/1018594-28367226.pdf?src-supplier=Element14; ComponentLink5Description: https://datasheet.ciiva.com/28367/1018594-28367226.pdf?src-supplier=Element14; ComponentLink6URL: https://datasheet.ciiva.com/16740/pyu-rc0402-51-rohs-l-6-r-16740566.pdf?src-supplier=Future+Electronics; ComponentLink6Description: https://datasheet.ciiva.com/16740/pyu-rc0402-51-rohs-l-6-r-16740566.pdf?src-supplier=Future+Electronics; ComponentLink7URL: https://datasheet.ciiva.com/15189/getdatasheetpartid-329466-15189335.pdf?src-supplier=Verical; ComponentLink7Description: https://datasheet.ciiva.com/15189/getdatasheetpartid-329466-15189335.pdf?src-supplier=Verical
R117 = RES_1M: Resistor 1MOhm 0402 SMD; Manufacturer: Yageo; Temperature Coefficient: 100ppm/°C; Tolerance: 1%; Power Rating: 63mW; Voltage Rating: 50V; ComponentLink1Description: https://datasheet.ciiva.com/11808/0900766b80c66297-11808125.pdf?src-supplier=RSComponents; ComponentLink1URL: https://datasheet.ciiva.com/11808/0900766b80c66297-11808125.pdf?src-supplier=RSComponents; Composition: Thick Film; Height: 0.32mm; Manufacturer Part Number: RC0402FR-071ML; Packaging: Tape and Reel; Pricing 1: 1=0.10000, 10=0.01500, 100=0.00600, 1000=0.00268, 2500=0.00232, 5000=0.00192 (USD); RoHS: Yes; Stock 1: 11890826; Supplier 1: Digi-Key; Case/Package: 0402; Case Code (Imperial): 0402; Case Code (Metric): 1005; Min Operating Temperature: -55°C; Max Operating Temperature: 155°C; Termination: SMD/SMT; Military Standard: Not; Length: 1mm; Depth: 0.5mm; REACH SVHC: Unknown; Lead Free: Lead Free; ComponentLink2URL: https://datasheet.ciiva.com/46394/1018594-46394951.pdf?src-supplier=Element14; ComponentLink2Description: https://datasheet.ciiva.com/46394/1018594-46394951.pdf?src-supplier=Element14; ComponentLink3URL: https://datasheet.ciiva.com/16741/pyu-rc0402-51-rohs-l-6-r-16741081.pdf?src-supplier=Future+Electronics; ComponentLink3Description: https://datasheet.ciiva.com/16741/pyu-rc0402-51-rohs-l-6-r-16741081.pdf?src-supplier=Future+Electronics; ComponentLink4URL: https://datasheet.ciiva.com/7849/1018594-7849882.pdf?src-supplier=Element14; ComponentLink4Description: https://datasheet.ciiva.com/7849/1018594-7849882.pdf?src-supplier=Element14; ComponentLink5URL: https://datasheet.ciiva.com/7849/1018594-7849883.pdf?src-supplier=Element14; ComponentLink5Description: https://datasheet.ciiva.com/7849/1018594-7849883.pdf?src-supplier=Element14
R120 = RES_12.1k: Resistor 12.1kOhm 0402 SMD; Manufacturer: Yageo; Temperature Coefficient: 100ppm/°C; Tolerance: 1%; Power Rating: 62.5mW; Voltage Rating: 50V; Max Power Dissipation: 63mW; ComponentLink1Description: https://datasheet.ciiva.com/11808/0900766b80d8d3b8-11808222.pdf?src-supplier=RSComponents; ComponentLink1URL: https://datasheet.ciiva.com/11808/0900766b80d8d3b8-11808222.pdf?src-supplier=RSComponents; Composition: Thick Film; Features: Moisture Resistant; Height: 0.016inch; Manufacturer Part Number: RC0402FR-0712K1L; Number of Terminations: 2; Packaging: Tape and Reel; Pricing 1: 1=0.10000, 10=0.01600, 100=0.00640, 1000=0.00289, 2500=0.00251, 5000=0.00207 (USD); RoHS: Yes; Stock 1: 2126835; Supplier 1: Digi-Key; Case/Package: 0402; Case Code (Metric): 1005; Case Code (Imperial): 0402; Min Operating Temperature: -55°C; Max Operating Temperature: 155°C; Package Quantity: 1; Termination: SMD/SMT; Military Standard: Not; Voltage Rating (DC): 50V; Length: 1mm; Width: 0.02inch; Depth: 0.5mm; REACH SVHC: No SVHC; Lead Free: Lead Free; ComponentLink2URL: https://datasheet.ciiva.com/2453/pyu-r-int-thick-7-2453488.pdf?src-supplier=Digi-Key; ComponentLink2Description: https://datasheet.ciiva.com/2453/pyu-r-int-thick-7-2453488.pdf?src-supplier=Digi-Key; ComponentLink3URL: https://datasheet.ciiva.com/17070/pyu-rc0402-51-rohs-l-6-r-17070757.pdf?src-supplier=Future+Electronics; ComponentLink3Description: https://datasheet.ciiva.com/17070/pyu-rc0402-51-rohs-l-6-r-17070757.pdf?src-supplier=Future+Electronics; ComponentLink4URL: https://datasheet.ciiva.com/2453/pyu-r-int-thick-7-2453489.pdf?src-supplier=Digi-Key; ComponentLink4Description: https://datasheet.ciiva.com/2453/pyu-r-int-thick-7-2453489.pdf?src-supplier=Digi-Key; ComponentLink5URL: https://datasheet.ciiva.com/7983/1018594-7983493.pdf?src-supplier=Element14; ComponentLink5Description: https://datasheet.ciiva.com/7983/1018594-7983493.pdf?src-supplier=Element14; ComponentLink6URL: https://datasheet.ciiva.com/2453/pyu-r-int-thick-7-2453487.pdf?src-supplier=Digi-Key; ComponentLink6Description: https://datasheet.ciiva.com/2453/pyu-r-int-thick-7-2453487.pdf?src-supplier=Digi-Key
X3 = Suntsu ITEMP 25MHz _0.005% 20pf: Manufacturer: Abracon Corporation; Manufacturer Part Number: ABM3-25.000MHZ-B2-T; Frequency: 25MHz; Frequency Stability: ±50ppm; Frequency Tolerance: ±20ppm; Load Capacitance: 18pF; ESR (Equivalent Series Resistance): 50 Ohm; Operating Mode: Fundamental; Supplier 1: Digi-Key; Supplier Part Number 1: 535-9108-6-ND; RoHS: RoHS Compliant; Category: Crystals and Oscillators; Stock 1: 23589; Pricing 1: 1=1.43, 10=1.235, 50=1.083, 100=0.855, 500=0.722 (USD); Type: MHz Crystal; Operating Temperature: -20°C ~ 70°C; Ratings: -; Mounting Type: Surface Mount; Package / Case: 2-SMD; Size / Dimension: 0.197" L x 0.126" W (5.00mm x 3.20mm); Height: 0.051" (1.30mm); Packaging: Digi-Reel®; ComponentLink1URL: http://www.abracon.com/Resonators/abm3.pdf; ComponentLink1Description: http://www.abracon.com/Resonators/abm3.pdf